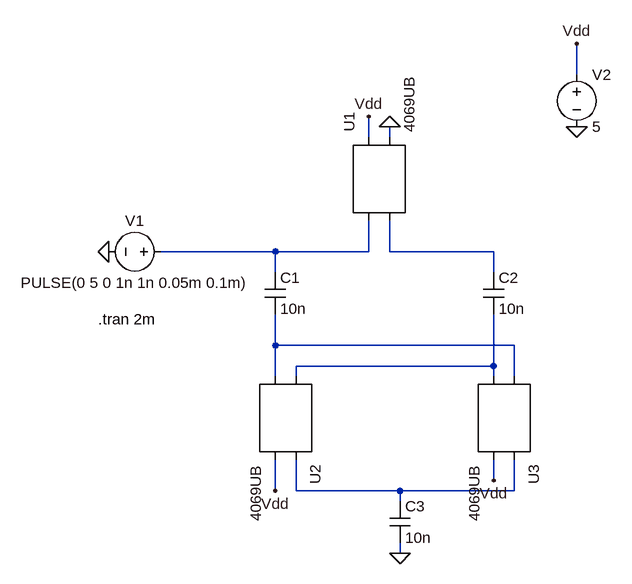
[diagram p0: schematic Q3.asc]
Q3.asc, the LTspice schematic file:
Version 4
SHEET 1 880 680
WIRE 656 -208 656 -256
WIRE 336 -112 336 -144
WIRE 368 -112 368 -128
WIRE 192 64 16 64
WIRE 336 64 336 16
WIRE 336 64 192 64
WIRE 368 64 368 16
WIRE 528 64 368 64
WIRE 192 96 192 64
WIRE 528 96 528 64
WIRE 192 208 192 160
WIRE 560 208 192 208
WIRE 528 240 528 160
WIRE 528 240 224 240
WIRE 192 256 192 208
WIRE 224 256 224 240
WIRE 528 256 528 240
WIRE 560 256 560 208
WIRE 528 416 528 384
WIRE 192 432 192 384
WIRE 224 432 224 384
WIRE 384 432 224 432
WIRE 560 432 560 384
WIRE 560 432 384 432
WIRE 384 448 384 432
WIRE 384 528 384 512
FLAG -64 64 0
FLAG 656 -128 0
FLAG 384 528 0
FLAG 656 -256 Vdd
FLAG 336 -144 Vdd
FLAG 192 432 Vdd
FLAG 528 416 Vdd
FLAG 368 -128 0
SYMBOL AutoGenerated\\4069UB 352 -48 R270
SYMATTR InstName U1
SYMBOL AutoGenerated\\4069UB 208 320 R90
SYMATTR InstName U2
SYMBOL AutoGenerated\\4069UB 544 320 R90
SYMATTR InstName U3
SYMBOL voltage 32 64 R90
WINDOW 0 -32 56 VBottom 2
WINDOW 3 32 56 VTop 2
WINDOW 123 0 0 Left 0
WINDOW 39 0 0 Left 0
SYMATTR InstName V1
SYMATTR Value PULSE(0 5 0 1n 1n 0.05m 0.1m)
SYMBOL voltage 656 -224 R0
SYMATTR InstName V2
SYMATTR Value 5
SYMBOL cap 176 96 R0
SYMATTR InstName C1
SYMATTR Value 10n
SYMBOL cap 512 96 R0
SYMATTR InstName C2
SYMATTR Value 10n
SYMBOL cap 368 448 R0
SYMATTR InstName C3
SYMATTR Value 10n
TEXT -80 168 Left 2 !.tran 2m

The netlist it stands for:
* Q3.asc
* U1: 4069UB (symbol AutoGenerated\4069UB not available, pins judged from their places): pin1=N001 pin2=N002 pin3=Vdd pin4=0
* U2: 4069UB (symbol AutoGenerated\4069UB not available, pins judged from their places): pin1=N004 pin2=N003 pin3=N005 pin4=Vdd
* U3: 4069UB (symbol AutoGenerated\4069UB not available, pins judged from their places): pin1=N003 pin2=N004 pin3=N005 pin4=Vdd
V1 N001 0 PULSE(0 5 0 1n 1n 0.05m 0.1m)
V2 Vdd 0 5
C1 N001 N003 10n
C2 N002 N004 10n
C3 N005 0 10n
.tran 2m
.backanno
.end